# EAGLE schematic LED Board (EAGLE 7.5.0)
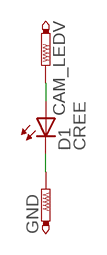
[diagram p0: schematic, sheet 1]

## Parts
CAM_LEDV  PTR1PAD1-20  [P1-20]
D1  CREE  [CREE-XLAMP-XM-L]
GND  PTR1PAD1-20  [P1-20]

## Nets
CAM_LEDV: CAM_LEDV.TP D1.A D1.A@1(A)
GND: D1.C D1.C1(C) D1.C@1(C) GND.TP

## Library data of the parts
CAM_LEDV GND = testpad:PTR1: TEST PIN
D1 = 2015_LED_Driver:CREE: Cree XBD model LED's digikey # XBDAWT-00-0000-000000F51CT-ND